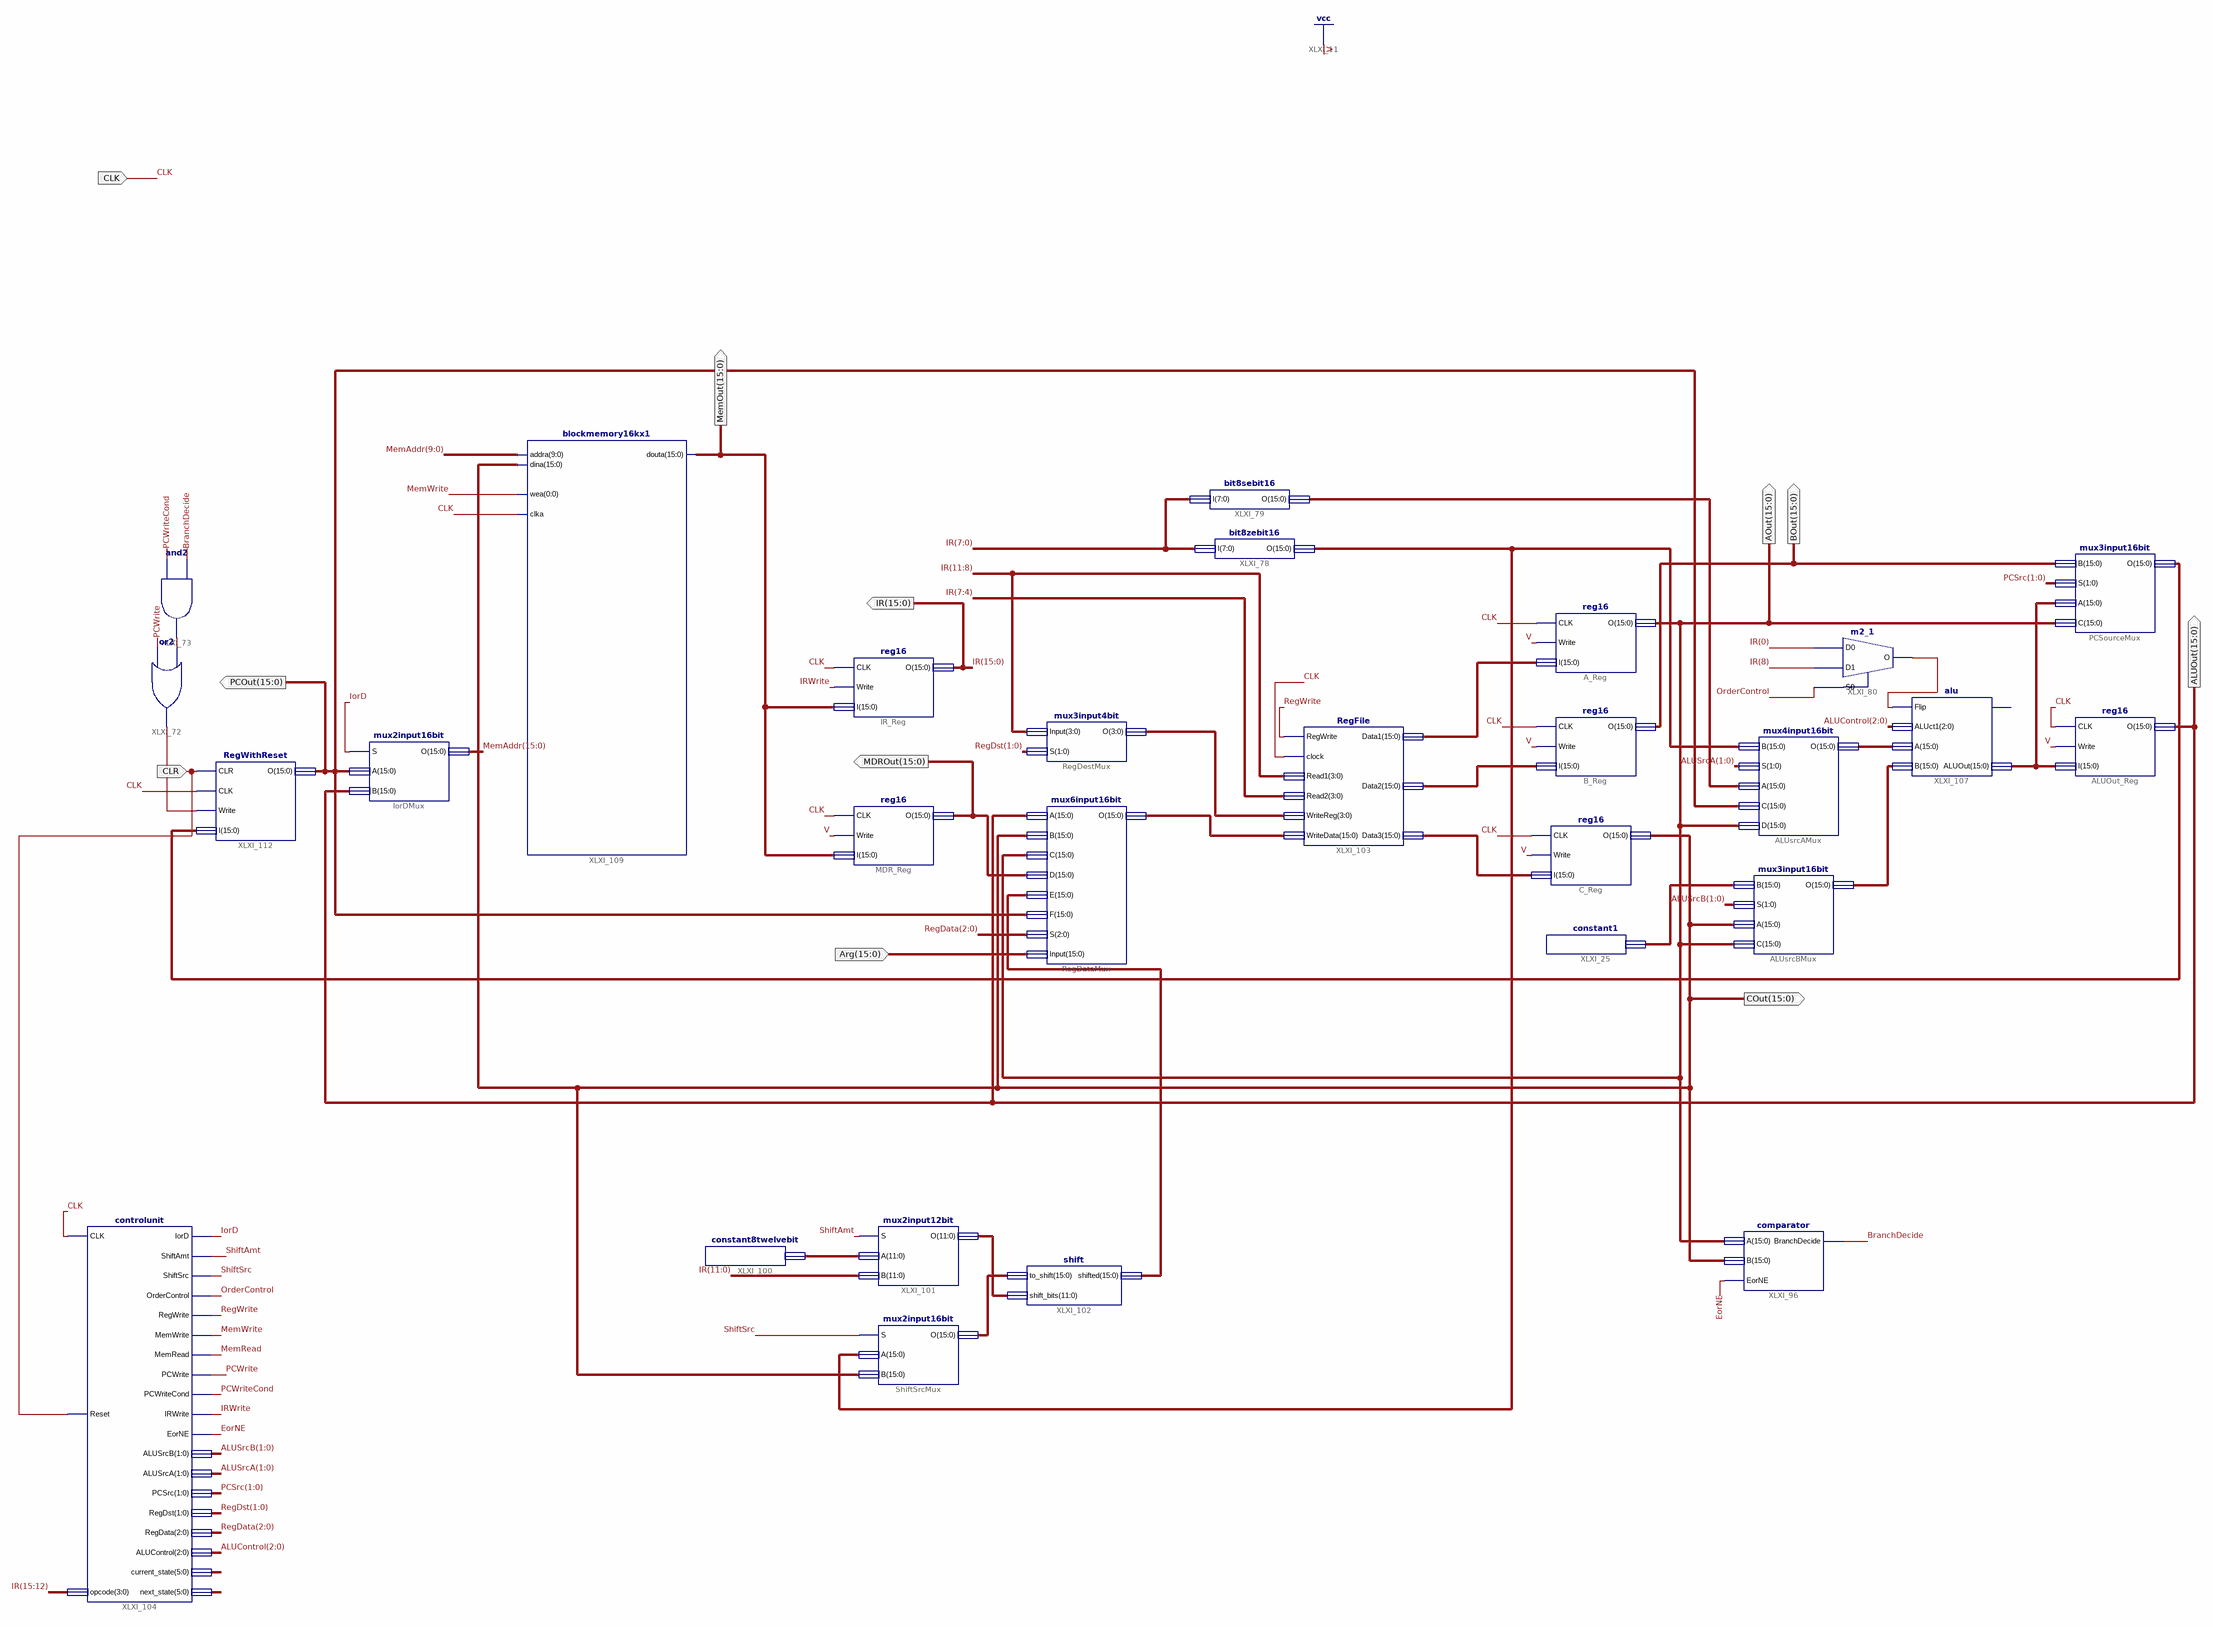
[diagram p0: schematic sheet 1]
// Xilinx ISE schematic Datapath.sch (spartan3adsp) as structural Verilog: 28 symbols, 11 ports
module Datapath (
  input  CLK,
  input  CLR,
  input  [15:0] Arg,
  output [15:0] BOut,
  output [15:0] MDROut,
  output [15:0] ALUOut,
  output [15:0] PCOut,
  output [15:0] IR,
  output [15:0] COut,
  output [15:0] AOut,
  output [15:0] MemOut
);

  wire BranchDecide, EorNE, IorD, IRWrite, MemRead, MemWrite, OrderControl, PCWrite, PCWriteCond, RegWrite,
       ShiftAmt, ShiftSrc, XLXN_144, XLXN_145, XLXN_216;
  wire [1:0] ALUSrcA, ALUSrcB, PCSrc, RegDst;
  wire [2:0] ALUControl, RegData;
  wire [3:0] XLXN_274;
  wire [5:0] XLXN_300, XLXN_301;
  wire [11:0] XLXN_256, XLXN_272;
  wire [15:0] MemAddr, XLXN_2, XLXN_3, XLXN_6, XLXN_100, XLXN_154, XLXN_176, XLXN_177, XLXN_273, XLXN_275,
       XLXN_276, XLXN_277, XLXN_278, XLXN_280;

  reg16 ALUOut_Reg (.CLK(CLK), .Write(1'b1), .I(XLXN_6), .O(ALUOut));
  mux4input16bit ALUsrcAMux (.B(XLXN_176), .S(ALUSrcA), .A(XLXN_177), .C(PCOut), .D(AOut), .O(XLXN_3));
  reg16 A_Reg (.CLK(CLK), .Write(1'b1), .I(XLXN_278), .O(AOut));
  reg16 C_Reg (.CLK(CLK), .Write(1'b1), .I(XLXN_276), .O(COut));
  reg16 B_Reg (.CLK(CLK), .Write(1'b1), .I(XLXN_277), .O(BOut));
  constant1 XLXI_25 (.O(XLXN_100));
  mux3input16bit PCSourceMux (.B(BOut), .S(PCSrc), .A(XLXN_6), .C(AOut), .O(XLXN_154));
  mux3input16bit ALUsrcBMux (.B(XLXN_100), .S(ALUSrcB), .A(COut), .C(AOut), .O(XLXN_2));
  mux2input16bit IorDMux (.S(IorD), .A(PCOut), .B(ALUOut), .O(MemAddr));
  or XLXI_72 (XLXN_145, PCWrite, XLXN_144);
  and XLXI_73 (XLXN_144, PCWriteCond, BranchDecide);
  bit8zebit16 XLXI_78 (.I(IR[7:0]), .O(XLXN_176));
  bit8sebit16 XLXI_79 (.I(IR[7:0]), .O(XLXN_177));
  m2_1 XLXI_80 (.D0(IR[0]), .D1(IR[8]), .S0(OrderControl), .O(XLXN_216));
  mux3input4bit RegDestMux (.Input(IR[11:8]), .S(RegDst), .O(XLXN_274));
  mux6input16bit RegDataMux (
    .A(ALUOut), .B(COut), .C(AOut), .D(MDROut), .E(XLXN_280), .F(PCOut), .S(RegData), .O(XLXN_275),
    .Input(Arg));
  reg16 MDR_Reg (.CLK(CLK), .Write(1'b1), .I(MemOut), .O(MDROut));
  reg16 IR_Reg (.CLK(CLK), .Write(IRWrite), .I(MemOut), .O(IR));
  comparator XLXI_96 (.A(AOut), .B(COut), .EorNE(EorNE), .BranchDecide(BranchDecide));
  mux2input12bit XLXI_101 (.S(ShiftAmt), .A(XLXN_256), .B(IR[11:0]), .O(XLXN_272));
  mux2input16bit ShiftSrcMux (.S(ShiftSrc), .A(XLXN_176), .B(COut), .O(XLXN_273));
  constant8twelvebit XLXI_100 (.O(XLXN_256));
  shift XLXI_102 (.to_shift(XLXN_273), .shift_bits(XLXN_272), .shifted(XLXN_280));
  RegFile XLXI_103 (
    .RegWrite(RegWrite), .clock(CLK), .Read1(IR[11:8]), .Read2(IR[7:4]), .WriteReg(XLXN_274),
    .WriteData(XLXN_275), .Data1(XLXN_278), .Data2(XLXN_277), .Data3(XLXN_276));
  controlunit XLXI_104 (
    .CLK(CLK), .Reset(CLR), .opcode(IR[15:12]), .IorD(IorD), .ShiftAmt(ShiftAmt), .ShiftSrc(ShiftSrc),
    .OrderControl(OrderControl), .RegWrite(RegWrite), .MemWrite(MemWrite), .MemRead(MemRead),
    .PCWrite(PCWrite), .PCWriteCond(PCWriteCond), .IRWrite(IRWrite), .EorNE(EorNE), .ALUSrcB(ALUSrcB),
    .ALUSrcA(ALUSrcA), .PCSrc(PCSrc), .RegDst(RegDst), .RegData(RegData), .ALUControl(ALUControl),
    .current_state(XLXN_300), .next_state(XLXN_301));
  alu XLXI_107 (.Flip(XLXN_216), .ALUct1(ALUControl), .A(XLXN_3), .B(XLXN_2), .ALUOut(XLXN_6));  // open: Zero
  blockmemory16kx1 XLXI_109 (.addra(MemAddr[9:0]), .dina(COut), .wea(MemWrite), .clka(CLK), .douta(MemOut));
  RegWithReset XLXI_112 (.CLR(CLR), .CLK(CLK), .Write(XLXN_145), .I(XLXN_154), .O(PCOut));
endmodule
